# EasyEDA Pro project 慢上掉电自动化_2.eprj, board PCB1
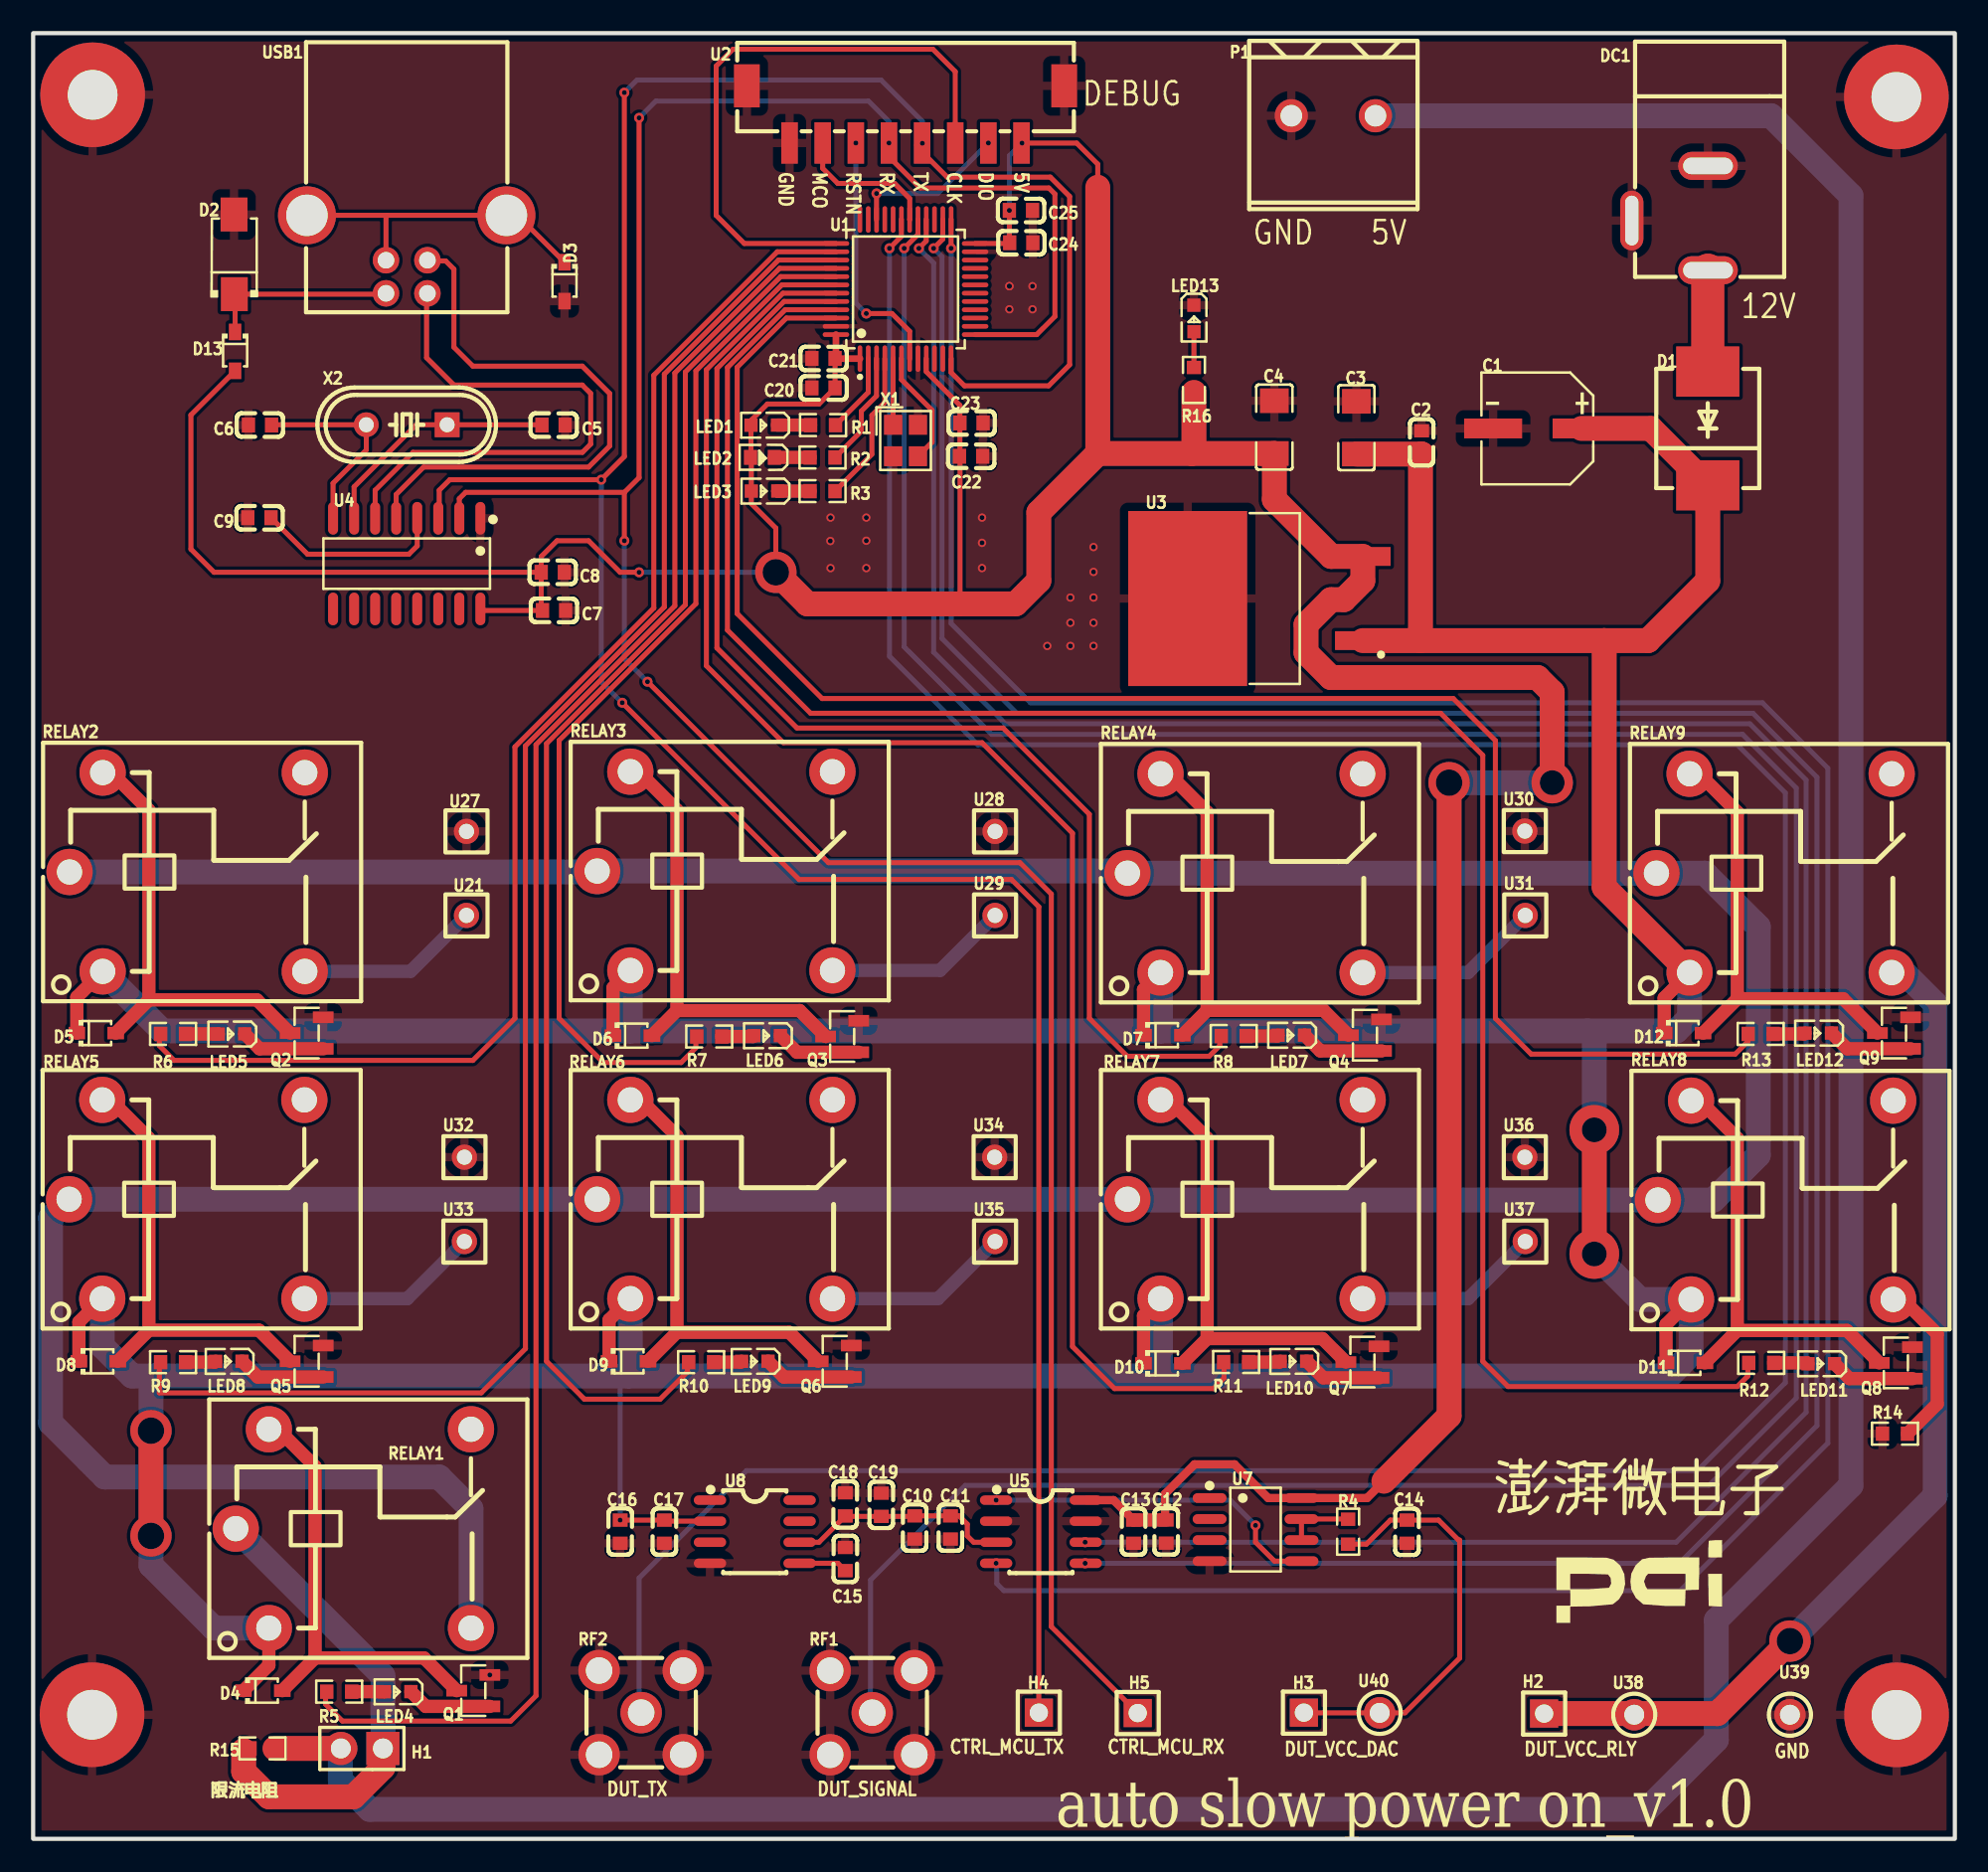
[diagram p6: board, top side]
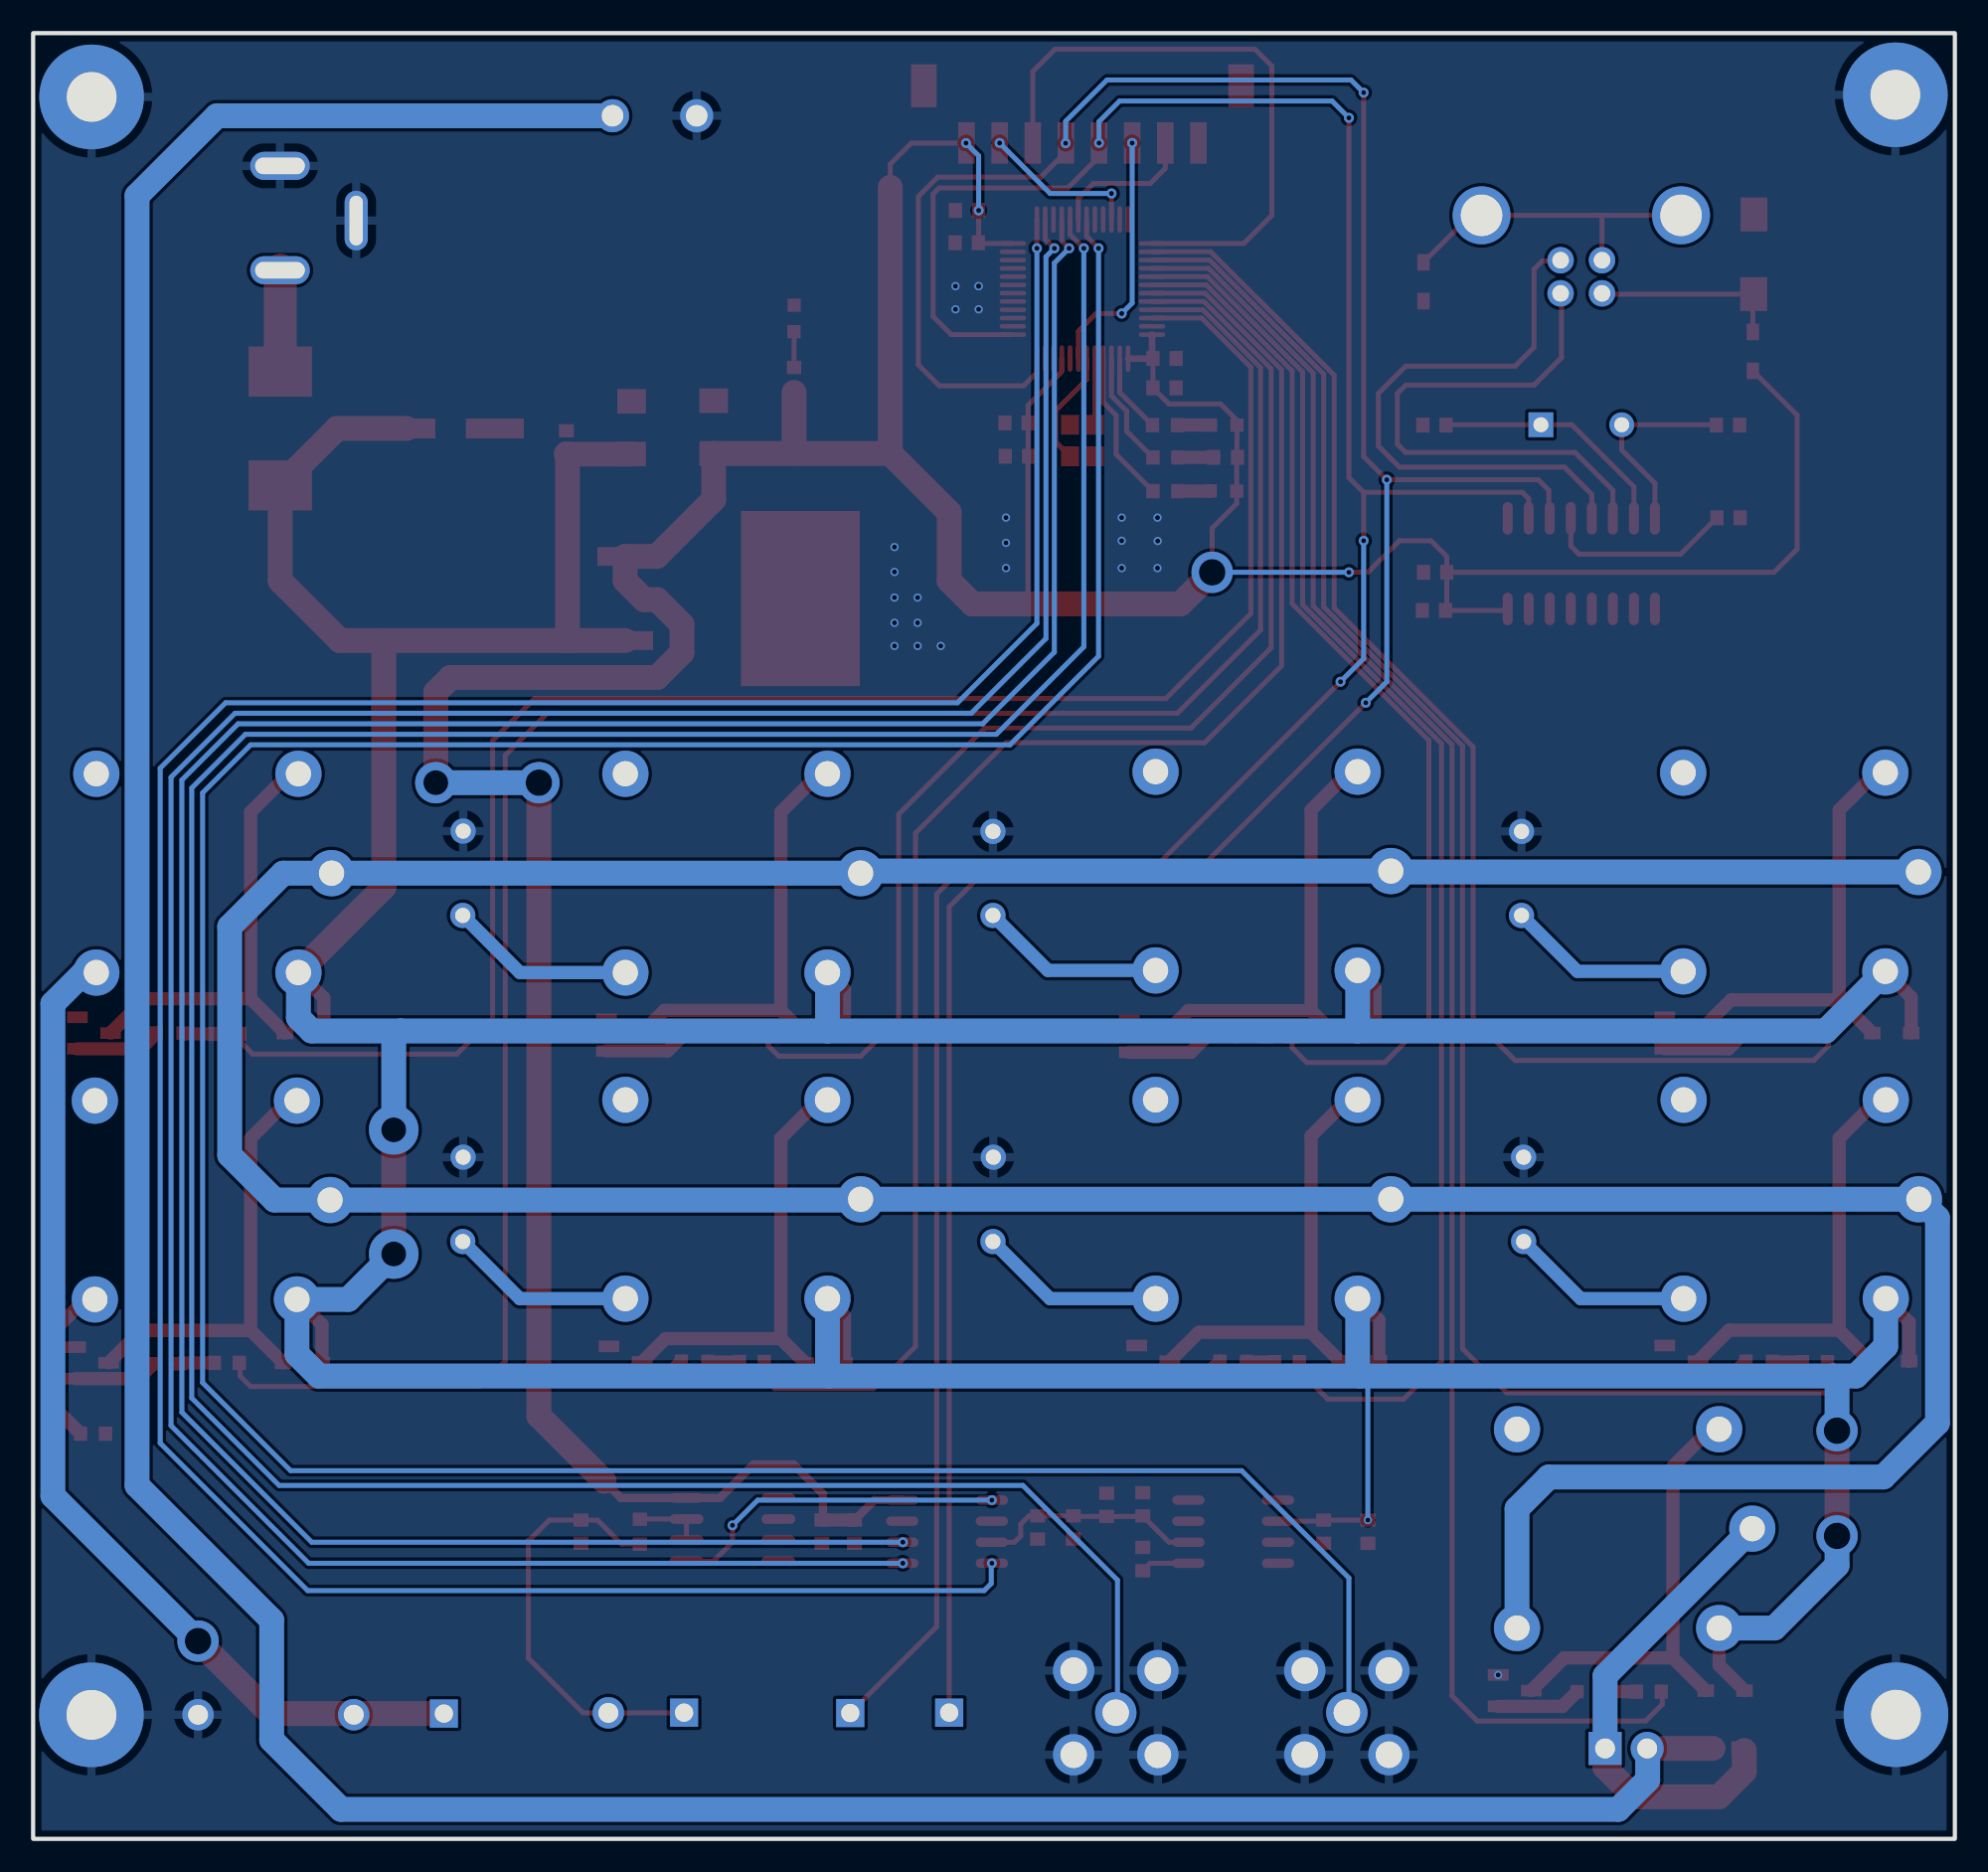
[diagram p7: board, bottom side, seen from below]

Outline 116 x 109 mm; copper layers: Top Layer, Bottom Layer. Coordinates in mm from the lower left corner of the outline.
Outline path: rectangle 0,109 116,0
Stack: Top Layer 0.035mm / Dielectric1 1.51mm FR4 er 4.5 / Bottom Layer 0.035mm

## Design rules (mm)
template: 自定义配置
spacing copperThickness1oz (default): track to track 0.102, other pairs 0.152 to 0.3
spacing copperThickness2oz: track to track 0.203, other pairs 0.152 to 0.3
track width copperThickness1oz (default): min 0.127, default 0.254, max 2.54
track width copperThickness2oz: min 0.203, default 0.254, max 2.54
differential pair differentialPair (default): width min 0.127, default 0.254, max 2.54; gap min 0.152, default 0.152
via viaSize (default): diameter min 0.5, default 0.61, max 10; hole min 0.3, default 0.305, max 6.3

## Placement (name value [footprint] x y rotation side)
C1  100uF  [CAP-SMD_BD6.3-L6.6-W6.6-LS7.6-FD-1]  90.8 85.14 180 top
C2  100nF  [C0603]  83.81 84.29 270 top
C3  10uF  [C1206]  79.87 85.18 270 top
C4  10uF  [C1206]  74.92 85.22 270 top
C5  22pF  [C0603]  31.42 85.34 180 top
C6  22pF  [C0603]  13.69 85.34 0 top
C7  100nF  [C0603]  31.44 74.15 0 top
C8  10uF  [C0603]  31.37 76.45 0 top
C9  100nF  [C0603]  13.66 79.75 180 top
C10  10uF  [C0603]  53.21 18.8 90 top
C11  100nF  [C0603]  55.37 18.8 90 top
C12  10uF  [C0603]  68.39 18.55 270 top
C13  100nF  [C0603]  66.42 18.54 270 top
C14  100nF  [C0603]  82.93 18.54 90 top
C15  1uF  [C0603]  49.02 16.89 270 top
C16  10uF  [C0603]  35.43 18.54 270 top
C17  100nF  [C0603]  38.1 18.54 270 top
C18  10uF  [C0603]  49.02 20.19 90 top
C19  1uF  [C0603]  51.2 20.17 90 top
C20  10uF  [C0603]  47.71 87.58 180 top
C21  100nF  [C0603]  47.71 89.36 180 top
C22  10uF  [C0603]  56.62 83.46 180 top
C23  100nF  [C0603]  56.64 85.47 180 top
C24  10uF  [C0603]  59.65 96.35 180 top
C25  100nF  [C0603]  59.63 98.3 180 top
D1  SS36-E3/57T  [SMC_L7.1-W6.2-LS8.1-R-RD]  101.08 85.14 90 top
D2  SMAJ5.0A  [SMA_L4.3-W2.6-LS5.0-RD]  12.14 95.65 90 top
D3  1N5819WS  [SOD-323_L1.8-W1.3-LS2.5-RD]  32.07 94 270 top
D4  1N4148WS  [SOD-323_L1.8-W1.3-LS2.5-RD]  13.87 8.95 0 top
D5  1N4148WS  [SOD-323_L1.8-W1.3-LS2.5-RD]  3.81 48.64 0 top
D6  1N4148WS  [SOD-323_L1.8-W1.3-LS2.5-RD]  36.18 48.49 0 top
D7  1N4148WS  [SOD-323_L1.8-W1.3-LS2.5-RD]  68.2 48.51 0 top
D8  1N4148WS  [SOD-323_L1.8-W1.3-LS2.5-RD]  3.94 28.83 0 top
D9  1N4148WS  [SOD-323_L1.8-W1.3-LS2.5-RD]  35.94 28.83 0 top
D10  1N4148WS  [SOD-323_L1.8-W1.3-LS2.5-RD]  68.2 28.7 0 top
D11  1N4148WS  [SOD-323_L1.8-W1.3-LS2.5-RD]  99.74 28.73 0 top
D12  1N4148WS  [SOD-323_L1.8-W1.3-LS2.5-RD]  99.63 48.64 0 top
D13  1N5819WS  [SOD-323_L1.8-W1.3-LS2.5-RD]  12.19 89.79 270 top
DC1  HX DC005 QT  [DC-IN-TH_HANXIA_HX-DC005-QT]  98.8 97.84 270 top
H1  PZ254V-11-02P  [HDR-TH_2P-P2.54-V-M]  19.84 5.46 180 top
H2  PZ254V-11-01P  [HDR-TH_1P-P2.54-V-M]  91.21 7.56 0 top
H3  PZ254V-11-01P  [HDR-TH_1P-P2.54-V-M]  76.71 7.62 0 top
H4  PZ254V-11-01P  [HDR-TH_1P-P2.54-V-M]  60.71 7.62 0 top
H5  PZ254V-11-01P  [HDR-TH_1P-P2.54-V-M]  66.68 7.6 0 top
J2  -  [DEMO板安装孔]  112.48 7.49 0 top
J3  -  [DEMO板安装孔]  3.56 7.49 0 top
J4  -  [DEMO板安装孔]  3.59 105.28 0 top
J5  -  [DEMO板安装孔]  112.47 105.15 0 top
LED1  NCD0603R1  [LED0603-RD_RED]  44.13 85.34 180 top
LED2  19-217/BHC-ZL1M2RY/3T  [LED0603-FD_BLUE]  44.02 83.39 180 top
LED3  19-217/GHC-YR1S2/3T  [LED0603-RD]  44.15 81.36 180 top
LED4  19-217/GHC-YR1S2/3T  [LED0603-RD]  22 8.89 180 top
LED5  19-217/GHC-YR1S2/3T  [LED0603-RD]  11.97 48.59 180 top
LED6  19-217/GHC-YR1S2/3T  [LED0603-RD]  44.31 48.49 180 top
LED7  19-217/GHC-YR1S2/3T  [LED0603-RD]  75.95 48.51 180 top
LED8  19-217/GHC-YR1S2/3T  [LED0603-RD]  11.81 28.83 180 top
LED9  19-217/GHC-YR1S2/3T  [LED0603-RD]  43.56 28.83 180 top
LED10  19-217/GHC-YR1S2/3T  [LED0603-RD]  76.07 28.83 180 top
LED11  19-217/GHC-YR1S2/3T  [LED0603-RD]  107.93 28.68 180 top
LED12  19-217/GHC-YR1S2/3T  [LED0603-RD]  107.75 48.64 180 top
LED13  19-217/GHC-YR1S2/3T  [LED0603-RD]  70.07 91.78 270 top
P1  WJ500V-5.08-2P  [CONN-TH_2P-P5.00_WJ500V-5.08-2P]  78.49 104.01 180 top
Q1  SS8050  [SOT-23-3_L2.9-W1.3-P1.90-LS2.4-BR]  26.57 8.95 0 top
Q2  SS8050  [SOT-23-3_L2.9-W1.3-P1.90-LS2.4-BR]  16.51 48.64 0 top
Q3  SS8050  [SOT-23-3_L2.9-W1.3-P1.90-LS2.4-BR]  48.83 48.43 0 top
Q4  SS8050  [SOT-23-3_L2.9-W1.3-P1.90-LS2.4-BR]  80.39 48.51 0 top
Q5  SS8050  [SOT-23-3_L2.9-W1.3-P1.90-LS2.4-BR]  16.51 28.83 0 top
Q6  SS8050  [SOT-23-3_L2.9-W1.3-P1.90-LS2.4-BR]  48.39 28.83 0 top
Q7  SS8050  [SOT-23-3_L2.9-W1.3-P1.90-LS2.4-BR]  80.24 28.78 0 top
Q8  SS8050  [SOT-23-3_L2.9-W1.3-P1.90-LS2.4-BR]  112.44 28.73 0 top
Q9  SS8050  [SOT-23-3_L2.9-W1.3-P1.90-LS2.4-BR]  112.33 48.64 0 top
R1  10kΩ  [R0603]  47.68 85.34 180 top
R2  10kΩ  [R0603]  47.65 83.39 180 top
R3  10kΩ  [R0603]  47.65 81.35 180 top
R4  22Ω  [R0603]  79.38 18.54 270 top
R5  10kΩ  [R0603]  18.47 8.89 0 top
R6  10kΩ  [R0603]  8.45 48.59 0 top
R7  10kΩ  [R0603]  40.81 48.43 0 top
R8  10kΩ  [R0603]  72.47 48.46 0 top
R9  10kΩ  [R0603]  8.45 28.78 0 top
R10  10kΩ  [R0603]  40.32 28.78 0 top
R11  10kΩ  [R0603]  72.62 28.78 0 top
R12  10kΩ  [R0603]  104.31 28.73 0 top
R13  10kΩ  [R0603]  104.28 48.59 0 top
R14  0Ω  [R0603]  112.39 24.46 0 top
R15  100Ω  [R0603]  13.84 5.46 180 top
R16  10kΩ  [R0603]  70.07 88.07 270 top
RELAY1  SRD-12VDC-SL-C  [RELAY-TH_SRD-XXVDC-XL-C]  19.33 18.73 0 top
RELAY2  SRD-12VDC-SL-C  [RELAY-TH_SRD-XXVDC-XL-C]  9.3 58.36 0 top
RELAY3  SRD-12VDC-SL-C  [RELAY-TH_SRD-XXVDC-XL-C]  41.15 58.42 0 top
RELAY4  SRD-12VDC-SL-C  [RELAY-TH_SRD-XXVDC-XL-C]  73.15 58.29 0 top
RELAY5  SRD-12VDC-SL-C  [RELAY-TH_SRD-XXVDC-XL-C]  9.27 38.61 0 top
RELAY6  SRD-12VDC-SL-C  [RELAY-TH_SRD-XXVDC-XL-C]  41.15 38.61 0 top
RELAY7  SRD-12VDC-SL-C  [RELAY-TH_SRD-XXVDC-XL-C]  73.15 38.61 0 top
RELAY8  SRD-12VDC-SL-C  [RELAY-TH_SRD-XXVDC-XL-C]  105.18 38.56 0 top
RELAY9  SRD-12VDC-SL-C  [RELAY-TH_SRD-XXVDC-XL-C]  105.09 58.29 0 top
RF1  KH-SMA-KE-Z  [SMA-TH_KH-SMA-KE-Z]  50.65 7.62 0 top
RF2  KH-SMA-KE-Z  [SMA-TH_KH-SMA-KE-Z]  36.7 7.62 0 top
U1  PT32A030C8T7  [LQFP-48_7.0X7.0X0.5P]  52.66 93.55 0 top
U2  A2008WV-S-8P  [CONN-SMD_A2008WV-S-8P]  52.66 104.09 180 top
U3  L7805CD2T-TR  [TO-263-2_L10.0-W9.1-P5.08-LS15.2-TL]  74.98 74.87 180 top
U4  CH340G  [SOIC-16_L9.9-W3.9-P1.27-LS6.0-BL]  22.55 76.98 180 top
U5  AD5541ARZ-REEL7  [SOIC-8_L5.0-W4.0-P1.27-LS6.0-BL]  60.83 18.54 270 top
U7  OPA2350UA/2K5  [SOIC-8_L4.9-W3.9-P1.27-LS6.0-BL]  73.79 18.67 270 top
U8  REF5050AIDR  [SOIC-8_L5.0-W4.0-P1.27-LS6.0-BL]  43.56 18.54 270 top
U21  X5511FV-01-C30D97-0970  [HDR-TH_1P-V-F-1]  26.16 55.74 0 top
U27  X5511FV-01-C30D97-0970  [HDR-TH_1P-V-F-1]  26.16 60.81 0 top
U28  X5511FV-01-C30D97-0970  [HDR-TH_1P-V-F-1]  58.06 60.81 0 top
U29  X5511FV-01-C30D97-0970  [HDR-TH_1P-V-F-1]  58.06 55.74 0 top
U30  X5511FV-01-C30D97-0970  [HDR-TH_1P-V-F-1]  90.04 60.83 0 top
U31  X5511FV-01-C30D97-0970  [HDR-TH_1P-V-F-1]  90.07 55.74 0 top
U32  X5511FV-01-C30D97-0970  [HDR-TH_1P-V-F-1]  26.03 41.15 0 top
U33  X5511FV-01-C30D97-0970  [HDR-TH_1P-V-F-1]  26.03 36.06 0 top
U34  X5511FV-01-C30D97-0970  [HDR-TH_1P-V-F-1]  58.04 41.15 0 top
U35  X5511FV-01-C30D97-0970  [HDR-TH_1P-V-F-1]  58.06 36.06 0 top
U36  X5511FV-01-C30D97-0970  [HDR-TH_1P-V-F-1]  90.04 41.15 0 top
U37  X5511FV-01-C30D97-0970  [HDR-TH_1P-V-F-1]  90.07 36.06 0 top
U38  RH-5000  [TEST-TH_BD2.54-P1.4_RED]  96.65 7.49 0 top
U39  RH-5000  [TEST-TH_BD2.54-P1.4_RED]  106.04 7.49 0 top
U40  RH-5000  [TEST-TH_BD2.54-P1.4_RED]  81.28 7.61 0 top
USB1  USB-B10-BRW  [USB-B-TH_USB-B10-BRW]  22.55 95.65 180 top
X1  25MHz  [OSC-SMD_4P-L2.5-W2.0-BL]  52.66 84.41 270 top
X2  12MHz  [HC-49US_L11.5-W4.5-P4.88]  22.55 85.36 180 top

## Footprints (pads in the part's own frame, mm; a bottom-side part is the same pattern mirrored in y, then rotated)
C0603
  rect 0.8x0.9 smd: 1(-0.7,0) 2(0.7,0)
C1206
  rect 1.485x1.728 smd: 1(-1.593,0) 2(1.593,0)
CAP-SMD_BD6.3-L6.6-W6.6-LS7.6-FD-1
  rect 3.5x1.2 smd: 1(-2.67,0) 2(2.67,0)
CONN-SMD_A2008WV-S-8P
  rect 1x2.5 smd: 1(-7,1.724) 2(-5,1.724) 3(-3,1.724) 4(-1,1.724) 5(1,1.724) 6(2.999,1.724) 7(5,1.724) 8(7,1.724)
  rect 1.55x2.6 smd: 9(-9.575,-1.724) 10(9.575,-1.724)
CONN-TH_2P-P5.00_WJ500V-5.08-2P
  round 2 hole 1.3: 1(-2.54,0) 2(2.54,0)
DC-IN-TH_HANXIA_HX-DC005-QT
  oval 3.6x1.4 hole 3x0.8: 2(0.15,-2.3)
  oval 1.7x3.6 hole 1x3: 3(-3.15,2.3) 4(3.15,2.3)
DEMO板安装孔
  round 6.32 hole 3: 1(0,0)
HC-49US_L11.5-W4.5-P4.88
  rect 1.5x1.5 hole 0.9: 1(-2.44,0)
  round 1.5 hole 0.9: 2(2.44,0)
HDR-TH_1P-P2.54-V-M
  rect 1.7x1.7 hole 1.1: 1(0,0)
HDR-TH_1P-V-F-1
  round 1.524 hole 0.914: 1(0,0)
HDR-TH_2P-P2.54-V-M
  rect 2x2 hole 1.2: 1(-1.27,0)
  round 2 hole 1.2: 2(1.27,0)
LED0603-FD_BLUE
  rect 0.8x0.9 smd: 1(-0.72,0) 2(0.72,0)
LED0603-RD
  rect 0.8x0.8 smd: 1(-0.799,-0.004) 2(0.799,0.004)
LED0603-RD_RED
  rect 0.8x0.8 smd: 1(-0.799,-0.004) 2(0.799,0.004)
LQFP-48_7.0X7.0X0.5P
  oval 0.28x1.6 smd: 1(-2.75,-4.2) 2(-2.25,-4.2) 3(-1.75,-4.2) 4(-1.25,-4.2) 5(-0.75,-4.2) 6(-0.25,-4.2) 7(0.25,-4.2) 8(0.75,-4.2) 9(1.25,-4.2) 10(1.75,-4.2) 11(2.25,-4.2) 12(2.75,-4.2) 25(2.75,4.2) 26(2.25,4.2) 27(1.75,4.2) 28(1.25,4.2) 29(0.75,4.2) 30(0.25,4.2) 31(-0.25,4.2) 32(-0.75,4.2) 33(-1.25,4.2) 34(-1.75,4.2) 35(-2.25,4.2) 36(-2.75,4.2)
  oval 1.6x0.28 smd: 13(4.2,-2.75) 14(4.2,-2.25) 15(4.2,-1.75) 16(4.2,-1.25) 17(4.2,-0.75) 18(4.2,-0.25) 19(4.2,0.25) 20(4.2,0.75) 21(4.2,1.25) 22(4.2,1.75) 23(4.2,2.25) 24(4.2,2.75) 37(-4.2,2.75) 38(-4.2,2.25) 39(-4.2,1.75) 40(-4.2,1.25) 41(-4.2,0.75) 42(-4.2,0.25) 43(-4.2,-0.25) 44(-4.2,-0.75) 45(-4.2,-1.25) 46(-4.2,-1.75) 47(-4.2,-2.25) 48(-4.2,-2.75)
OSC-SMD_4P-L2.5-W2.0-BL
  rect 1.2x1.1 smd: 1(-0.95,-0.75) 2(0.95,-0.75) 3(0.95,0.75) 4(-0.95,0.75)
R0603
  rect 0.806x0.864 smd: 1(-0.753,0) 2(0.753,0)
RELAY-TH_SRD-XXVDC-XL-C
  round 2.794 hole 1.524: 1(-5.1,-6) 2(7.1,-6) 3(7.1,6) 4(-5.1,6) 5(-7.1,0)
SMA-TH_KH-SMA-KE-Z
  round 2.5 hole 1.6: 1(-2.54,-2.54) 2(-2.54,2.54) 3(2.54,2.54) 4(2.54,-2.54) 5(-0.001,0.001)
SMA_L4.3-W2.6-LS5.0-RD
  rect 2.046x1.62 smd: 1(-2.404,-0.009) 2(2.404,0.009)
SMC_L7.1-W6.2-LS8.1-R-RD
  rect 3.03x3.82 smd: 1(3.435,0) 2(-3.435,0)
SOD-323_L1.8-W1.3-LS2.5-RD
  rect 1x0.75 smd: 1(-1.173,0) 2(1.173,0)
SOIC-8_L4.9-W3.9-P1.27-LS6.0-BL
  oval 0.588x2.045 smd: 1(-1.905,-2.772) 2(-0.635,-2.772) 3(0.635,-2.772) 4(1.905,-2.772) 5(1.905,2.772) 6(0.635,2.772) 7(-0.635,2.772) 8(-1.905,2.772)
SOIC-8_L5.0-W4.0-P1.27-LS6.0-BL
  oval 0.569x1.95 smd: 1(-1.905,-2.705) 2(-0.635,-2.705) 3(0.635,-2.705) 4(1.905,-2.705) 5(1.905,2.705) 6(0.635,2.705) 7(-0.635,2.705) 8(-1.905,2.705)
SOIC-16_L9.9-W3.9-P1.27-LS6.0-BL
  oval 0.602x1.971 smd: 1(-4.445,-2.736) 2(-3.175,-2.736) 3(-1.905,-2.736) 4(-0.635,-2.736) 5(0.635,-2.736) 6(1.905,-2.736) 7(3.175,-2.736) 8(4.445,-2.736) 9(4.445,2.736) 10(3.175,2.736) 11(1.905,2.736) 12(0.635,2.736) 13(-0.635,2.736) 14(-1.905,2.736) 15(-3.175,2.736) 16(-4.445,2.736)
SOT-23-3_L2.9-W1.3-P1.90-LS2.4-BR
  rect 1.25x0.7 smd: 1(1,-0.95) 2(1,0.95) 3(-1,0)
TEST-TH_BD2.54-P1.4_RED
  round 1.9 hole 1.2: 1(0,0)
TO-263-2_L10.0-W9.1-P5.08-LS15.2-TL
  rect 3.358x1.134 smd: 1(-5.286,2.54) 3(-5.286,-2.54)
  rect 7.181x10.566 smd: 4(5.286,0)
USB-B-TH_USB-B10-BRW
  round 1.6 hole 1: 1(1.25,2.355) 2(-1.25,2.355) 3(-1.25,0.355) 4(1.25,0.355)
  round 3.5 hole 2.5: 5(-6.02,-2.355) 6(6.02,-2.355)

## Nets
As in the schematic.

Pads without a net: RELAY1 3; RELAY2 3; RELAY3 3; RELAY4 3; RELAY5 3; RELAY6 3; RELAY7 3; RELAY8 3; RELAY9 3; U1 10 11 14 15 16 17 18 19 20 21 22 27 32 33 35 36; U4 9 10 11 12 13 14 15; U7 1 2 3; U8 1 3 7 8

## Via types
v1: diameter 2.5, hole 1.6, Top Layer to Bottom Layer, 5 vias
v2: diameter 0.6, hole 0.3, Top Layer to Bottom Layer, 13 vias
v3: diameter 0.61, hole 0.305, Top Layer to Bottom Layer, 12 vias
v4: diameter 2.5, hole 1.5, Top Layer to Bottom Layer, 1 via
v5: diameter 0.5, hole 0.3, Top Layer to Bottom Layer, 25 vias
v6: diameter 3, hole 1.5, Top Layer to Bottom Layer, 2 vias

## Routing (per net, layer and track width the routed paths; a pad name or vN(x,y) marks a point on that pad's centre or on a via; arc(x,y) is an arc through that point)
GND:
  vias: v5(27.57,9.9) v5(48.13,79.76) v5(48.12,78.34) v5(48.13,76.71) v5(50.29,79.76) v5(50.29,78.36) v5(50.29,76.71) v5(57.28,79.76) v5(57.28,78.23) v5(57.28,76.71) v5(58.93,93.73) v5(58.93,93.73) v5(58.93,92.33) v5(60.32,93.73) v5(60.32,92.33) v5(61.21,72.01) v5(62.61,74.93) v5(62.61,73.41) v5(62.61,72.01) v5(64.01,77.98) v5(64.01,76.48) v5(64.01,74.93) v5(64.01,73.41) v5(64.01,72.01)
DAC_OUT: length 20.6
  Top Layer w0.3: U7.5 74.93,16.76 73.79,17.91 v2(73.79,18.92)
  Bottom Layer w0.3: v2(73.79,18.92) 72.26,20.45 v2(58.13,20.45)
DC_5V: length 218.7
  Top Layer w1.5: H1.2 18.57,5.46 R15.1
  Bottom Layer w1.5: H1.2 18.54,5.43 18.54,3.56 20.32,1.78 97.41,1.78 101.6,5.97 101.6,13.21 109.73,21.34 109.73,99.19 104.9,104.01 P1.1
DC_12V: length 389.1
  Top Layer w0.3: U8.2 38.17,19.18 38.1,19.24 v5(35.43,19.24)
  Top Layer w0.8: D8.1 2.76,31.2 RELAY5.1 ; RELAY2.1 2.64,50.8 D5.1 ; D12.1 98.45,50.76 RELAY9.1 ; RELAY3.1 35,51.38 D6.1 ; RELAY4.1 67.03,51.27 D7.1 ; RELAY7.1 67.03,31.58 D10.1 ; D11.1 98.57,31.05 RELAY8.1 ; RELAY6.1 34.77,31.33 D9.1 ; 14.23,12.73 14.23,10.48 D4.1
  Top Layer w1.5: 83.81,83.59 83.74,83.53 83.74,72.33 ; 83.81,83.59 C2.2 ; 83.81,83.59 C3.2 ; 94.83,72.33 83.74,72.33 ; 94.83,72.33 97.48,72.33 101.08,75.94 D1.2 97.65,85.14 C1.1 ; 94.83,72.33 94.83,57.45 RELAY9.1 ; 83.74,72.33 U3.1 ; v6(94.23,35.31) v6(94.23,42.8) ; v1(7.11,24.64) v1(7.11,18.29)
  Bottom Layer w0.3: 35.93,27.94 35.43,27.45 v5(35.43,19.24)
  Bottom Layer w1.5: RELAY5.1 4.17,29.74 5.97,27.94 7.35,27.94 ; RELAY6.1 36.05,28.06 35.93,27.94 ; 68.07,48.77 93.82,48.77 ; 68.07,48.77 68.05,48.79 RELAY4.1 ; 68.07,48.77 36.06,48.77 ; 93.82,48.77 99.19,48.77 99.99,49.57 RELAY9.1 ; 93.82,48.77 94.23,48.36 v6(94.23,42.8) ; RELAY7.1 68.05,28.05 67.94,27.94 ; 35.93,27.94 67.94,27.94 ; 35.93,27.94 7.35,27.94 ; 7.35,27.94 7.11,27.71 v1(7.11,24.64) ; RELAY2.1 7.79,48.77 36.06,48.77 ; 36.06,48.77 36.05,48.79 RELAY3.1 ; 67.94,27.94 98.76,27.94 100.08,29.26 RELAY8.1 96.98,32.56 v6(94.23,35.31) ; v1(7.11,18.29) 7.11,16.51 10.9,12.73 14.23,12.73
DUT_TX: length 202
  Top Layer w0.3: v3(51.69,96.01) 52.41,96.73 U1.31
  Bottom Layer w0.3: RF2.5 36.58,7.75 36.58,15.75 43.05,22.22 100.46,22.22 105.77,27.54 105.77,63.14 102.87,66.04 57.03,66.04 51.69,71.39 v3(51.69,96.01)
DUT_VCC_DAC: length 25.7
  Top Layer w0.3: R4.2 80.48,17.79 81.93,19.24 84.84,19.24 86.04,18.03 86.11,18.03 86.11,10.91 82.8,7.61 U40.1 76.72,7.61 H3.1
DUT_VCC_RLY: length 62.3
  Top Layer w1: 96.58,7.56 U38.1
  Top Layer w1.5: H2.1 101.67,7.56 v1(106.04,11.94)
  Bottom Layer w1.5: v1(106.04,11.94) 114.81,20.7 114.81,50.42 112.93,52.29 112.19,52.29
GET_DUT_SIGNAL: length 188.8
  Top Layer w0.3: U1.29 53.41,96.84 v3(52.58,96.01)
  Bottom Layer w0.3: v3(52.58,96.01) 52.58,71.95 57.86,66.68 103.18,66.68 106.43,63.43 106.43,26.61 101.15,21.34 56.26,21.34 50.55,15.62 50.55,7.72 50.65,7.62
LDO_5V: length 274.5
  Top Layer w0.3: U1.24 58.9,96.3 58.93,96.28 58.93,98.18 ; C8.1 10.92,76.45 9.53,77.85 9.53,85.95 D13.2 ; C8.1 30.67,77.41 31.62,78.36 33.53,78.36 35.43,76.45 v2(36.58,76.45) ; C8.1 30.67,74.23 C7.1 27.09,74.15 ; 55.95,74.55 55.95,83.43 C22.2 55.94,83.48 C23.2 55.94,86.54 53.91,88.57 U1.9 ; 64.26,99.7 64.26,101.09 62.99,102.36 v2(59.69,102.36) ; v1(44.83,76.45) 44.83,79.12 43.35,80.6 LED3.2 43.35,83.34 LED2.2 43.33,83.42 LED1.2 43.33,85.62 44.32,86.61 47.44,86.61 48.41,87.58 48.41,89.36
  Top Layer w0.4: U1.1 48.42,89.35 48.41,89.36 ; U1.48 48.46,89.41
  Top Layer w0.5: C12.1 68.33,19.32 68.33,20.83 70.1,22.61 72.52,22.61 74.55,20.57 U7.8 80.52,20.57 81.53,21.59 ; U4.16 27.09,74.15 ; 66.42,19.24 65.22,20.45 U5.8
  Top Layer w0.8: C12.1 66.43,19.25 66.42,19.24
  Top Layer w1.5: v4(91.69,63.75) 91.69,69.22 90.81,70.1 78.34,70.1 76.84,71.6 76.84,73.3 78.34,74.8 79.12,74.8 80.26,75.94 U3.3 78.36,77.41 74.92,80.85 C4.2 69.94,83.63 ; v1(44.83,76.45) 46.74,74.55 59.31,74.55 60.71,75.95 60.71,80.07 64.26,83.63 ; R16.2 70.07,83.75 69.94,83.63 ; 69.94,83.63 64.26,83.63 ; 64.26,83.63 64.26,99.7 ; v1(85.47,63.75) 85.47,25.53 81.53,21.59
  Bottom Layer w0.3: v1(44.83,76.45) v2(36.58,76.45) ; v3(58.93,98.3) 58.93,101.6 v2(59.69,102.36)
  Bottom Layer w1.5: v1(85.47,63.75) v4(91.69,63.75)
LED_BLUE: length 7
  Top Layer w0.3: R2.1 49.99,84.97 49.99,86.19 50.91,87.1 U1.3
LED_GREEN: length 9.2
  Top Layer w0.3: U1.4 51.41,86.71 50.63,85.93 50.63,83.58 R3.1
LED_RED: length 4.8
  Top Layer w0.3: U1.2 50.41,87.31 48.43,85.34
MCO: length 8.8
  Top Layer w0.3: U1.30 52.91,97.76 52.91,99.01 52,99.93 48.57,99.93 47.66,100.84 U2.7
OSC_IN: length 4
  Top Layer w0.3: U1.5 X1.1
OSC_OUT: length 7
  Top Layer w0.3: U1.6 52.41,88.09 54.26,86.24 54.26,84.31 X1.3
REF_5V: length 13.6
  Top Layer w0.3: U8.6 47.44,17.91 C18.1 49.05,19.47 C19.1 53.18,19.47 C10.2 C11.2 55.89,19.5 56.39,19 56.39,18.29 56.77,17.91 U5.3
RLY1_CTRL: length 110.2
  Top Layer w0.3: U1.40 45.06,94.8 38.73,88.48 38.73,74.43 30.35,66.05 30.35,8.64 28.83,7.11 18.67,7.11 17.65,8.13 17.65,8.82 R5.1
RLY2_CTRL: length 80
  Top Layer w0.3: R6.1 7.62,48.52 7.62,47.88 8.51,46.99 26.54,46.99 29.08,49.53 29.08,65.91 37.47,74.3 37.47,88.35 44.92,95.8 U1.38
RLY3_CTRL: length 63.5
  Top Layer w0.3: U1.42 45.19,93.8 40,88.62 40,74.56 31.75,66.31 31.75,49.53 34.42,46.86 39.12,46.86 40,47.75 40,48.38 R7.1
RLY4_CTRL: length 74.4
  Top Layer w0.3: R8.1 71.63,48.37 71.63,47.88 70.99,47.24 66.04,47.24 63.75,49.53 63.75,61.85 58.55,67.06 46.11,67.06 41.28,71.89 41.28,88.75 45.33,92.8 U1.44
RLY5_CTRL: length 100.6
  Top Layer w0.3: R9.1 7.62,28.7 7.62,26.92 27.05,26.92 29.72,29.59 29.72,65.98 38.1,74.36 38.1,88.42 44.99,95.3 U1.39
RLY6_CTRL: length 85.4
  Top Layer w0.3: R10.1 39.5,28.7 39.5,28.19 37.85,26.54 33.27,26.54 30.99,28.83 30.99,66.11 39.37,74.49 39.37,88.55 45.12,94.3 U1.41
RLY7_CTRL: length 96.3
  Top Layer w0.3: R11.1 71.88,28.76 71.88,27.81 71.25,27.18 65.28,27.18 62.74,29.72 62.74,60.71 57.28,66.17 45.28,66.17 40.64,70.81 40.64,88.68 45.26,93.3 U1.43
RLY8_CTRL: length 126.9
  Top Layer w0.3: R12.1 103.5,28.68 103.5,27.94 102.87,27.31 89.03,27.31 87.5,28.83 87.5,65.41 84.96,67.95 46.93,67.95 41.91,72.96 41.91,88.82 45.4,92.3 U1.45
RLY9_CTRL: length 104.7
  Top Layer w0.3: R13.1 103.5,48.57 103.5,48.13 102.74,47.37 90.42,47.37 88.27,49.53 88.27,66.29 85.72,68.83 47.62,68.83 42.5,73.96 42.5,88.84 45.47,91.8 U1.46
RSTN: length 15.3
  Top Layer w0.3: U1.7 52.91,91 51.84,92.08 v3(50.29,92.08)
  Bottom Layer w0.3: v3(50.29,92.08) 49.66,92.71 v3(49.66,102.37)
SPI_CS: length 176.9
  Top Layer w0.3: U1.25 v3(55.41,96.01)
  Bottom Layer w0.3: v2(58.13,16.64) 58.17,16.6 58.17,15.41 58.59,14.99 99.43,14.99 108.33,23.89 108.33,64.63 104.38,68.58 60.2,68.58 55.41,73.37 v3(55.41,96.01)
SPI_MOSI: length 167.5
  Top Layer w0.3: U1.28 53.91,96.45 v3(53.47,96.01)
  Bottom Layer w0.3: v3(53.47,96.01) 54.36,95.12 54.36,71.63 58.68,67.31 103.63,67.31 107.02,63.92 107.02,25.75 99.18,17.91 v3(63.5,17.91)
SPI_SCK: length 168.8
  Top Layer w0.3: U1.26 54.91,96.57 v3(54.36,96.01)
  Bottom Layer w0.3: v3(63.5,16.64) 99.37,16.64 107.68,24.94 107.68,64.08 103.81,67.95 59.38,67.95 54.86,72.46 54.86,95.5 v3(54.36,96.01)
SWCLK: length 36.7
  Top Layer w0.3: U1.37 42.92,96.3 41.23,98 41.23,107.01 42.25,108.03 54.31,108.03 55.66,106.68 U2.3
SWDIO: length 9.6
  Top Layer w0.3: U1.34 v3(50.91,99.32)
  Bottom Layer w0.3: v3(50.91,99.32) 54.61,99.32 v3(57.66,102.37)
UART_RX: length 169.3
  Top Layer w0.3: v2(37.08,69.85) 48.01,58.93 59.56,58.93 61.46,57.03 61.46,12.81 H5.1 ; v2(35.69,78.36) 35.69,81.28 35.69,81.28 ; 35.69,81.28 36.58,82.17 v2(36.58,103.89) ; 35.69,81.28 26.11,81.28 25.72,80.9 U4.2 ; v2(51.66,102.37) 51.66,101.54 53.54,99.65 61.31,99.65 61.68,99.29 61.68,91.9 60.58,90.8 U1.13
  Bottom Layer w0.3: v2(37.08,69.85) 35.69,71.25 v2(35.69,78.36) ; v2(51.66,102.37) 51.66,103.66 50.42,104.9 37.59,104.9 v2(36.58,103.89)
UART_TX: length 179
  Top Layer w0.3: H4.1 60.71,56.26 59.06,57.91 46.23,57.91 v2(35.56,68.58) ; U2.4 v2(53.68,102.35) 53.68,101.81 55.17,100.31 61.4,100.31 62.57,99.14 62.57,88.98 61.3,87.71 56.22,87.71 55.41,88.52 U1.12 ; v2(35.69,105.41) 35.69,83.44 v2(34.29,82.04) 25.15,82.04 24.51,81.41 24.51,79.77 U4.3
  Top Layer w0.5: 34.27,82.06 v2(34.29,82.04)
  Top Layer w0.8: v2(53.68,102.35) 53.59,102.27 53.59,102.24
  Bottom Layer w0.3: v2(35.69,105.41) 36.45,106.17 51.18,106.17 53.68,103.68 v2(53.68,102.35) ; v2(35.56,68.58) 34.29,69.85 v2(34.29,82.04)
USB_D+: length 35.8
  Top Layer w0.3: U4.5 21.91,81.15 23.57,82.8 33.53,82.8 34.8,84.07 34.8,87.25 33.15,88.9 26.54,88.9 25.4,90.04 25.4,94.75 24.9,95.25 23.84,95.25 USB1.3
USB_D-: length 33.6
  Top Layer w0.3: U4.6 20.64,81.41 22.93,83.69 33.16,83.69 33.66,84.19 33.66,87.25 33.15,87.76 25.4,87.76 23.75,89.41 23.75,93.24 USB1.2
$1N739: length 2
  Top Layer w0.8: LED3.1 44.96,81.35 ; 44.96,81.35 44.95,81.35 ; 44.96,81.35 R3.2
$1N740: length 2
  Top Layer w0.8: R1.2 46.92,85.34 LED1.1
$1N744: length 2.2
  Top Layer w0.8: LED2.1 46.89,83.39 R2.2
$2N132: length 6.1
  Top Layer w2: D1.1 101.08,94.67 DC1.4
$2N1943: length 2.9
  Top Layer w0.3: U8.5 48.58,16.64 C15.2
$2N2720: length 2.2
  Top Layer w0.3: LED13.2 70.07,90.98 R16.1
$3N289: length 11.5
  Top Layer w0.3: USB1.1 21.25,93.24 12.14,93.24 12.19,93.2 D13.1
$3N717: length 14.8
  Top Layer w0.3: U4.7 19.37,81.61 23.12,85.36 X2.1 30.7,85.36 C5.2
$3N720: length 12.2
  Top Layer w0.3: U4.8 18.1,81.83 20.11,83.84 X2.2 14.41,85.36 C6.2
$3N945: length 11.6
  Top Layer w0.3: U4.4 23.18,78.05 22.68,77.55 16.56,77.55 C9.1
$3N993: length 19.5
  Top Layer w0.3: 21.37,98 21.3,97.93 USB1.4 ; 21.37,98 USB1.6 ; 21.37,98 USB1.5 29.24,98 D3.1
$5N715: length 3.9
  Top Layer w0.3: U7.6 U7.7 79.22,19.3
$6N2399: length 5.1
  Top Layer w0.8: LED4.1 23.7,8 Q1.1
$6N2435: length 2
  Top Layer w0.8: LED4.2 21.2,8.89 R5.2
$6N2519: length 5.1
  Top Layer w0.8: Q2.1 13.67,47.69 LED5.1
$6N2555: length 2
  Top Layer w0.8: R6.2 11.17,48.59 LED5.2
$6N3018: length 2
  Top Layer w0.8: R7.2 43.46,48.43 LED6.2
$6N3020: length 5.1
  Top Layer w0.8: LED6.1 46.11,47.48 Q3.1
$6N3329: length 1.9
  Top Layer w0.8: LED7.2 75.1,48.46 R8.2
$6N3331: length 5
  Top Layer w0.8: LED7.1 77.7,47.56 Q4.1
$6N3966: length 1.8
  Top Layer w0.8: R9.2 10.96,28.78 LED8.2
$6N3968: length 5.3
  Top Layer w0.8: LED8.1 13.56,27.88 Q5.1
$6N4277: length 1.7
  Top Layer w0.8: R10.2 42.71,28.78 LED9.2
$6N4279: length 5.4
  Top Layer w0.8: Q6.1 45.31,27.88 LED9.1
$6N4588: length 1.9
  Top Layer w0.8: LED10.2 75.23,28.78 R11.2
$6N4590: length 4.8
  Top Layer w0.8: LED10.1 77.87,27.83 Q7.1
$6N4862: length 5.1
  Top Layer w0.8: LED11.1 109.64,27.78 Q8.1
$6N4864: length 2.1
  Top Layer w0.8: LED11.2 107.08,28.73 R12.2
$6N7937: length 5.2
  Top Layer w0.8: LED12.1 109.51,47.69 Q9.1
$6N7938: length 1.9
  Top Layer w0.8: R13.2 106.9,48.59 106.95,48.64
$6N8376: length 10.3
  Top Layer w0.8: RELAY8.2 112.85,32.56 114.94,30.48 114.94,26.26 R14.2
$6N8481: length 27.3
  Top Layer w0.8: RELAY5.4 4.67,44.61 6.98,42.29 6.98,30.7 ; Q5.3 13.63,30.7 6.98,30.7 ; D8.2 6.98,30.7
$6N8494: length 27.3
  Top Layer w0.8: D9.2 38.86,30.58 ; 38.86,30.58 38.86,42.42 36.67,44.61 RELAY6.4 ; 38.86,30.58 45.64,30.58 Q6.3
$6N8516: length 26.9
  Top Layer w0.8: Q7.3 77.82,30.2 70.87,30.2 ; 70.87,30.2 70.87,42.29 68.55,44.61 RELAY7.4 ; 70.87,30.2 D10.2
$6N8536: length 27
  Top Layer w0.8: 70.87,50.01 77.9,50.01 Q4.3 ; 70.87,50.01 D7.2 ; 70.87,50.01 70.87,61.98 68.55,64.29 RELAY4.4
$6N8545: length 27.6
  Top Layer w0.8: D6.2 38.86,50 ; 38.86,50 46.27,50 Q3.3 ; 38.86,50 38.86,62.1 36.55,64.42 RELAY3.4
$6N8554: length 27.4
  Top Layer w0.8: D5.2 6.98,50.64 ; 6.98,50.64 6.98,62.1 4.72,64.36 RELAY2.4 ; 6.98,50.64 13.51,50.64 Q2.3
$6N8572: length 27.4
  Top Layer w0.8: 14.23,24.73 14.77,24.73 17.02,22.48 17.02,10.92 ; 17.02,10.92 23.59,10.92 Q1.3 ; 17.02,10.92 D4.2
$6N8587: length 11.2
  Bottom Layer w0.8: RELAY2.2 22.78,52.36 U21.1
$6N8589: length 11.2
  Bottom Layer w0.8: RELAY3.2 54.74,52.42 U29.1
$6N8591: length 11.2
  Bottom Layer w0.8: RELAY4.2 86.62,52.29 U31.1
$6N8593: length 11.1
  Bottom Layer w0.8: U33.1 22.58,32.61 RELAY5.2
$6N8597: length 11.2
  Bottom Layer w0.8: RELAY6.2 54.62,32.61 U35.1
$6N8599: length 11.2
  Bottom Layer w0.8: RELAY7.2 86.62,32.61 U37.1
$6N9026: length 268.9
  Bottom Layer w1.5: RELAY1.2 26.43,19.93 24.51,21.84 4.32,21.84 1.05,25.11 1.05,37.49 RELAY5.5 RELAY6.5 RELAY7.5 66.1,38.56 RELAY8.5 101.43,38.56 104.13,41.27 104.13,55.07 100.91,58.29 RELAY9.5 RELAY4.5 65.93,58.42 RELAY3.5 33.99,58.36 RELAY2.5
$6N11153: length 29.1
  Top Layer w1.5: 12.71,5.33 12.71,4.06 14.23,2.54 19.34,2.54 21.11,4.31 H1.1
  Bottom Layer w1.5: 12.23,18.73 21.11,9.84 H1.1
$6N13186: length 27.4
  Top Layer w0.8: D12.2 102.87,50.71 ; 102.87,50.71 109.25,50.71 Q9.3 ; 102.87,50.71 102.87,61.98 100.55,64.29 RELAY9.4
$6N13204: length 27.5
  Top Layer w0.8: 102.87,30.69 102.87,42.29 100.6,44.56 RELAY8.4 ; 102.87,30.69 D11.2 ; 102.87,30.69 109.48,30.69 Q8.3

## Copper pours and planes (outline as drawn; the poured copper is in the pictures)
GND on Top Layer: 0,109 116,109 116,0 0,0
GND on Bottom Layer: 0,109 116,109 116,0 0,0

## Text on the board
Top Silkscreen Layer: DUT_TX | DUT_SIGNAL | CTRL_MCU_TX | CTRL_MCU_RX | DUT_VCC_DAC | DUT_VCC_RLY | GND | MCO | RSTN | RX | TX | CLK | 5V | DIO | DEBUG | 12V | auto slow power on_v1.0 | 澎湃微电子 | 限流电阻
